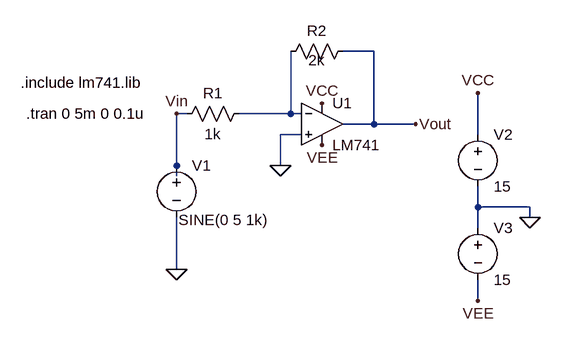
[diagram p0: schematic 1_inverting_amplifier.asc]
1_inverting_amplifier.asc, the LTspice schematic file:
Version 4
SHEET 1 880 680
WIRE 288 48 240 48
WIRE 0 144 -16 144
WIRE 160 144 160 48
WIRE 160 144 80 144
WIRE 176 144 160 144
WIRE 288 160 288 48
WIRE 288 160 240 160
WIRE 352 160 288 160
WIRE 176 176 144 176
WIRE 448 176 448 112
WIRE -16 224 -16 144
WIRE 144 224 144 176
WIRE -16 240 -16 224
WIRE 448 288 448 256
WIRE 528 288 448 288
WIRE 528 304 528 288
WIRE 448 320 448 288
WIRE -16 384 -16 304
WIRE 0 384 -16 384
WIRE 448 432 448 400
FLAG -16 384 0
FLAG 144 224 0
FLAG 528 304 0
FLAG 448 112 VCC
FLAG 208 128 VCC
FLAG 208 192 VEE
FLAG 448 432 VEE
FLAG -16 144 Vin
FLAG 352 160 Vout
SYMBOL res 96 128 R90
WINDOW 0 0 56 VBottom 2
WINDOW 3 32 56 VTop 2
SYMATTR InstName R1
SYMATTR Value 1k
SYMBOL res 256 32 R90
WINDOW 0 0 56 VBottom 2
WINDOW 3 14 56 VTop 2
SYMATTR InstName R2
SYMATTR Value 2k
SYMBOL voltage -16 208 R0
WINDOW 123 0 0 Left 0
WINDOW 39 0 0 Left 0
WINDOW 3 3 100 Left 2
SYMATTR Value SINE(0 5 1k)
SYMATTR InstName V1
SYMBOL voltage 448 160 R0
WINDOW 123 0 0 Left 0
WINDOW 39 0 0 Left 0
SYMATTR InstName V2
SYMATTR Value 15
SYMBOL voltage 448 304 R0
WINDOW 123 0 0 Left 0
WINDOW 39 0 0 Left 0
SYMATTR InstName V3
SYMATTR Value 15
SYMBOL OpAmps\\opamp2 208 96 R0
SYMATTR InstName U1
SYMATTR Value LM741
TEXT -248 144 Left 2 !.tran 0 5m 0 0.1u
TEXT -256 96 Left 2 !.include lm741.lib

The netlist it stands for:
* 1_inverting_amplifier.asc
R1 N001 Vin 1k
R2 Vout N001 2k
V1 Vin 0 SINE(0 5 1k)
V2 VCC 0 15
V3 0 VEE 15
XU1 0 N001 VCC VEE Vout LM741  ; pins In+ In- V+ V- OUT
.tran 0 5m 0 0.1u
.include lm741.lib
.backanno
.end